# EAGLE design power system (EAGLE 7.1.0)
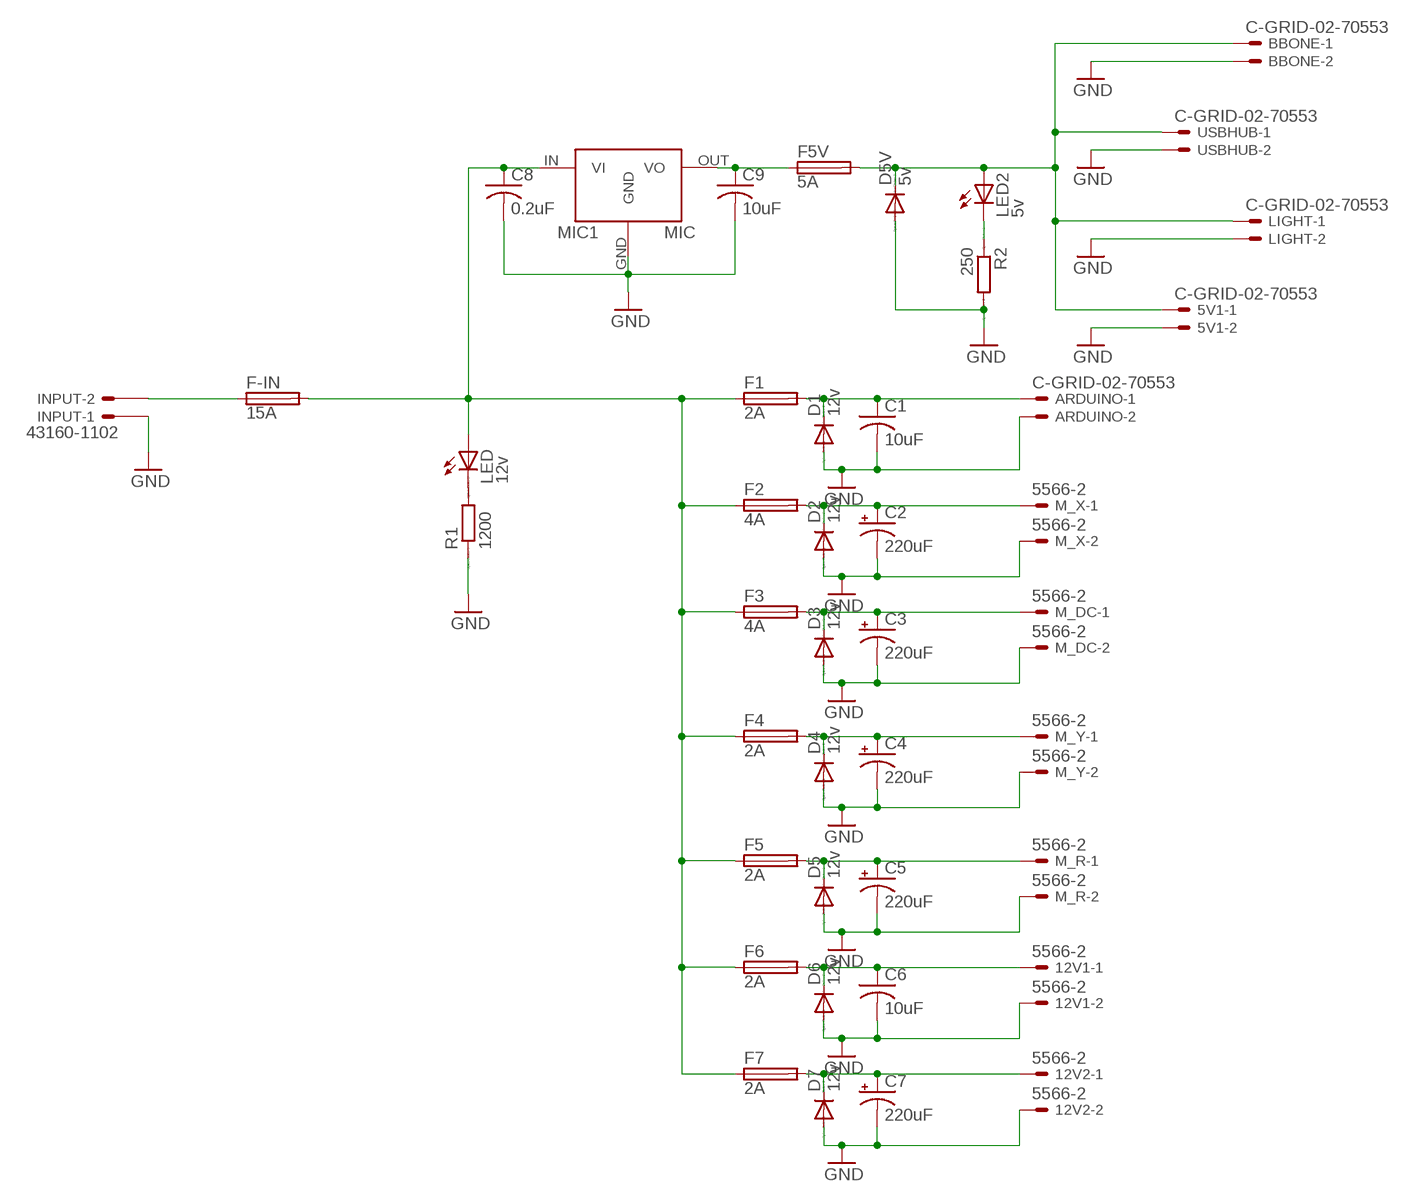
[diagram p0: schematic, sheet 1]

## Parts
5V1  C-GRID-02-70553  [70553-02]
12V1  5566-2  [5566-2]
12V2  5566-2  [5566-2]
ARDUINO  C-GRID-02-70553  [70553-02]
BBONE  C-GRID-02-70553  [70553-02]
C1  10uF  C-USC1206  [C1206]
C2  220uF  CAP_POLF80  [NIPPON_F80]
C3  220uF  CAP_POLF80  [NIPPON_F80]
C4  220uF  CAP_POLF80  [NIPPON_F80]
C5  220uF  CAP_POLF80  [NIPPON_F80]
C6  10uF  C-USC1206  [C1206]
C7  220uF  CAP_POLF80  [NIPPON_F80]
C8  0.2uF  C-USC1206  [C1206]
C9  10uF  C-USC1206  [C1206]
D1  12v  DIODE-DO214AC  [DO214AC]
D2  12v  DIODE-DO214AC  [DO214AC]
D3  12v  DIODE-DO214AC  [DO214AC]
D4  12v  DIODE-DO214AC  [DO214AC]
D5  12v  DIODE-DO214AC  [DO214AC]
D5V  5v  DIODE-DO214AC  [DO214AC]
D6  12v  DIODE-DO214AC  [DO214AC]
D7  12v  DIODE-DO214AC  [DO214AC]
F1  2A  TE5  [TE5]
F2  4A  TE5  [TE5]
F3  4A  TE5  [TE5]
F4  2A  TE5  [TE5]
F5  2A  TE5  [TE5]
F5V  5A  TE5  [TE5]
F6  2A  TE5  [TE5]
F7  2A  TE5  [TE5]
F-IN  15A  FUSEBLANK_5X20MM  [FUSE_HOLDER_5X20MM]
INPUT  43160-1102  [43160-XX02]
LED  12v  LED5MM  [LED5MM]
LED2  5v  LED5MM  [LED5MM]
LIGHT  C-GRID-02-70553  [70553-02]
M_DC  5566-2  [5566-2]
M_R  5566-2  [5566-2]
M_X  5566-2  [5566-2]
M_Y  5566-2  [5566-2]
MIC1  MIC29300  [TO220CS]
R1  1200  RR1206  [R1206]
R2  250  RR1206  [R1206]
USBHUB  C-GRID-02-70553  [70553-02]

## Nets
GND: 5V1.2 12V1.2 12V2.2 ARDUINO.2 BBONE.2 C1.2 C2.- C3.- C4.- C5.- C6.2 C7.- C8.2 C9.2 D1.A D2.A D3.A D4.A D5.A D5V.A D6.A D7.A INPUT.1@1(-1:S) LIGHT.2 M_DC.2 M_R.2 M_X.2 M_Y.2 MIC1.GND R1.1 R2.2 USBHUB.2
N$2: ARDUINO.1 C1.1 D1.C F1.2
N$3: F-IN.1 INPUT.2@1(-2:S)
N$4: C2.+ D2.C F2.2 M_X.1
N$5: 5V1.1 BBONE.1 D5V.C F5V.2 LED2.A LIGHT.1 USBHUB.1
N$6: C3.+ D3.C F3.2 M_DC.1
N$7: C9.1 F5V.1 MIC1.OUT(VO)
N$8: C8.1 F1.1 F2.1 F3.1 F4.1 F5.1 F6.1 F7.1 F-IN.2 LED.A MIC1.IN(VI)
N$9: LED2.K(C) R2.1
N$12: C4.+ D4.C F4.2 M_Y.1
N$14: LED.K(C) R1.2
N$15: C5.+ D5.C F5.2 M_R.1
N$17: 12V1.1 C6.1 D6.C F6.2
N$19: 12V2.1 C7.+ D7.C F7.2
Unconnected: INPUT.1@2(-1:S) INPUT.2@2(-2:S)

## Library data of the parts
5V1 ARDUINO BBONE LIGHT USBHUB = con-molex:C-GRID-02: CONNECTOR wire to board 2.54 mm (0.100") pitch header; OC_FARNELL: unknown; OC_NEWARK: unknown
12V1 12V2 M_DC M_R M_X M_Y = con-molex:5566-2: Mini FIT connector 2 pol Source: http://www.molex.com; OC_FARNELL: 1822072; OC_NEWARK: unknown
C1 C6 C8 C9 = resistor:C-US: CAPACITOR, American symbol
C2-C5 C7 = SparkFun-Capacitors:CAP_POL: Capacitor Polarized These are standard SMD and PTH capacitors. Normally 10uF, 47uF, and 100uF in electrolytic and tantalum varieties. Always verify the external diameter of the through hole cap, it varies with capacity, voltage, and manufacturer. The EIA devices should be standard.
D1-D5 D5V D6 D7 = diode:DIODE-: DIODE
F1-F5 F5V F6 F7 = fuse:TE5: FUSE Wickmann; OC_FARNELL: unknown; OC_NEWARK: unknown
F-IN = fuse:FUSE: Fuse; OC_FARNELL: unknown; OC_NEWARK: unknown
INPUT = con-molex:43160-*02: SDA-43160 Connector Source: http://www.molex.com/pdm_docs/sd/431601306_sd.pdf; MF: WALDOM/MOLEX; MPN: 43160-1102; OC_FARNELL: unknown; OC_NEWARK: 54H0255
LED LED2 = led:LED: LED OSRAM: - CHIPLED LG R971, LG N971, LY N971, LG Q971, LY Q971, LO R971, LY R971 LH N974, LH R974 LS Q976, LO Q976, LY Q976 LO Q996 - Hyper CHIPLED LW Q18S LB Q993, LB Q99A, LB R99A - SideLED LS A670, LO A670, LY A670, LG A670, LP A670 LB A673, LV A673, LT A673, LW A673 LH A674 LY A675 LS A676, LA A676, LO A676, LY A676, LW A676 LS A679, LY A679, LG A679 - Hyper Micro SIDELED® LS Y876, LA Y876, LO Y876, LY Y876 LT Y87S - SmartLED LW L88C, LW L88S LB L89C, LB L89S, LG L890 LS L89K, LO L89K, LY L89K LS L896, LA L896, LO L896, LY L896 - TOPLED LS T670, LO T670, LY T670, LG T670, LP T670 LSG T670, LSP T670, LSY T670, LOP T670, LYG T670 LG T671, LOG T671, LSG T671 LB T673, LV T673, LT T673, LW T673 LH T674 LS T676, LA T676, LO T676, LY T676, LB T676, LH T676, LSB T676, LW T676 LB T67C, LV T67C, LT T67C, LS T67K, LO T67K, LY T67K, LW E67C LS E67B, LA E67B, LO E67B, LY E67B, LB E67C, LV E67C, LT E67C LW T67C LS T679, LY T679, LG T679 LS T770, LO T770, LY T770, LG T770, LP T770 LB T773, LV T773, LT T773, LW T773 LH T774 LS E675, LA E675, LY E675, LS T675 LS T776, LA T776, LO T776, LY T776, LB T776 LHGB T686 LT T68C, LB T68C - Hyper Mini TOPLED® LB M676 - Mini TOPLED Santana® LG M470 LS M47K, LO M47K, LY M47K Source: http://www.osram.convergy.de LUXEON: - LUMILED® LXK2-PW12-R00, LXK2-PW12-S00, LXK2-PW14-U00, LXK2-PW14-V00 LXK2-PM12-R00, LXK2-PM12-S00, LXK2-PM14-U00 LXK2-PE12-Q00, LXK2-PE12-R00, LXK2-PE12-S00, LXK2-PE14-T00, LXK2-PE14-U00 LXK2-PB12-K00, LXK2-PB12-L00, LXK2-PB12-M00, LXK2-PB14-N00, LXK2-PB14-P00, LXK2-PB14-Q00 LXK2-PR12-L00, LXK2-PR12-M00, LXK2-PR14-Q00, LXK2-PR14-R00 LXK2-PD12-Q00, LXK2-PD12-R00, LXK2-PD12-S00 LXK2-PH12-R00, LXK2-PH12-S00 LXK2-PL12-P00, LXK2-PL12-Q00, LXK2-PL12-R00 Source: www.luxeon.com KINGBRIGHT: KA-3528ASYC Source: www.kingbright.com
MIC1 = Powerlib:MIC29300
R1 R2 = eagle-ltspice:R: RESISTOR, European symbol; SPICEMODEL: NONE; SPICEPREFIX: R

## Board
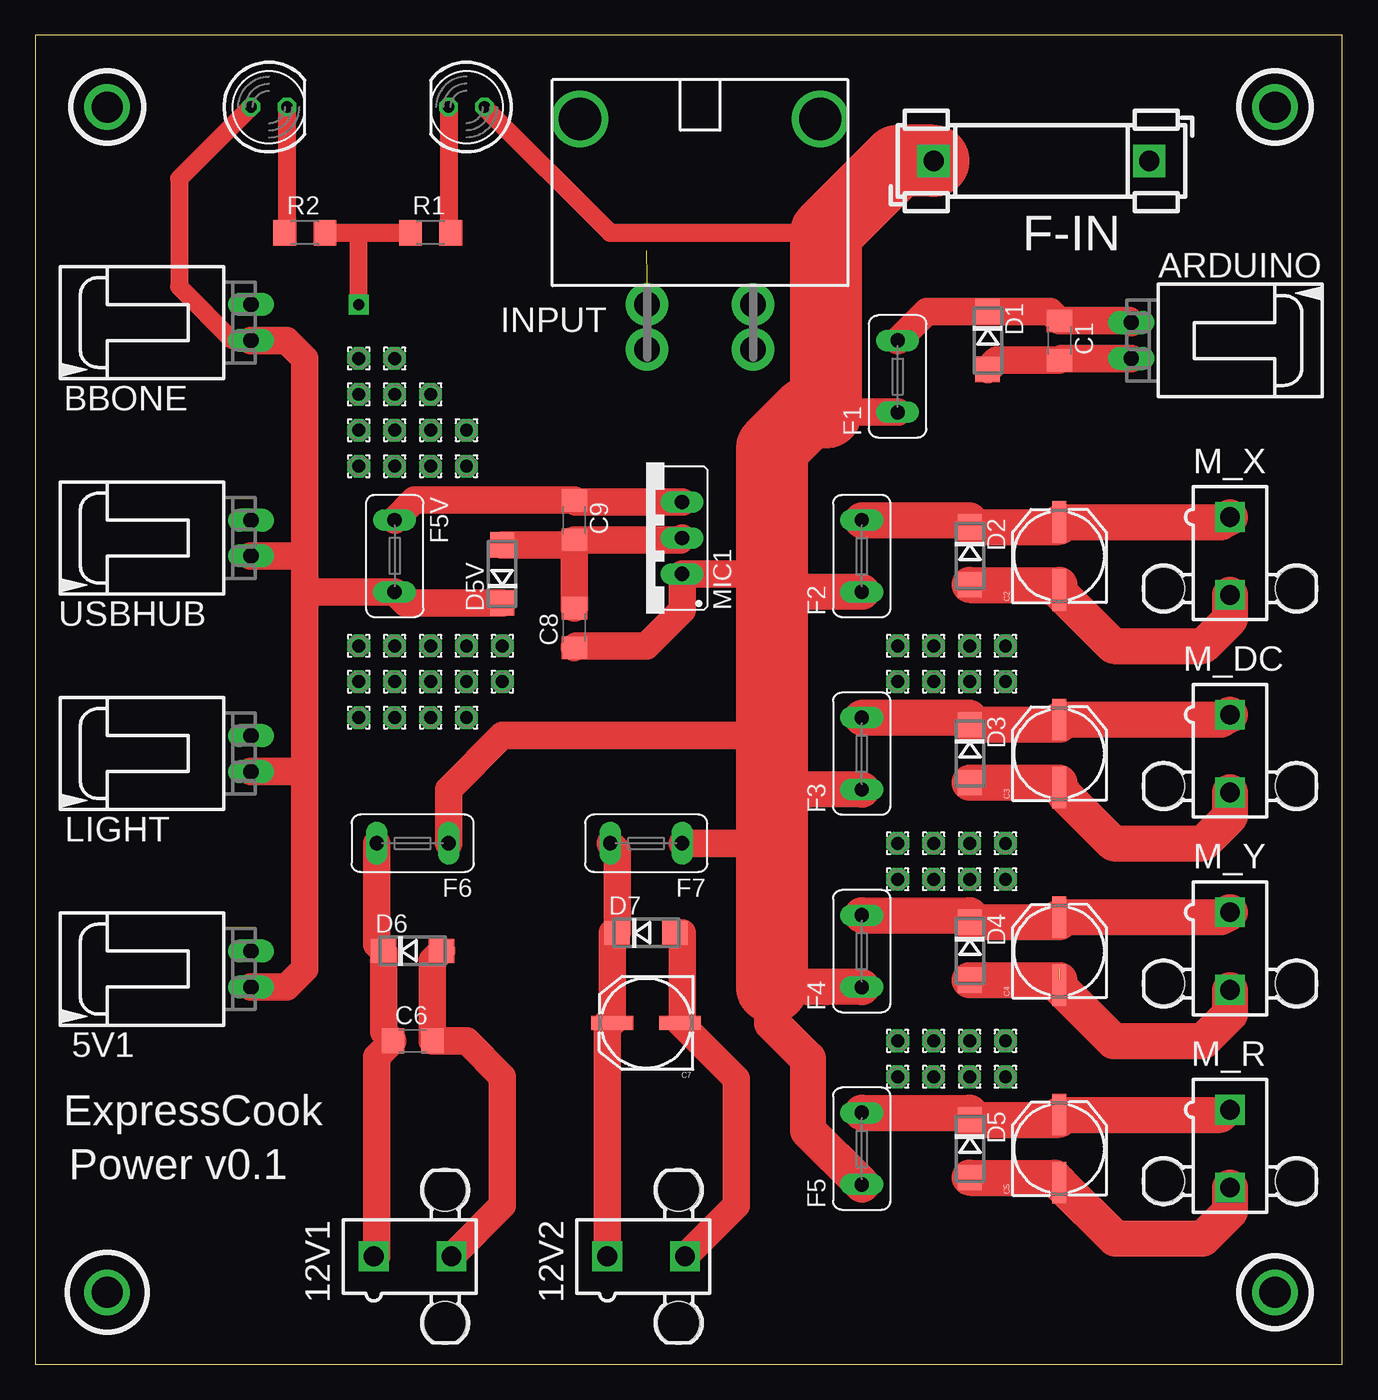
[diagram p1: board, top side]
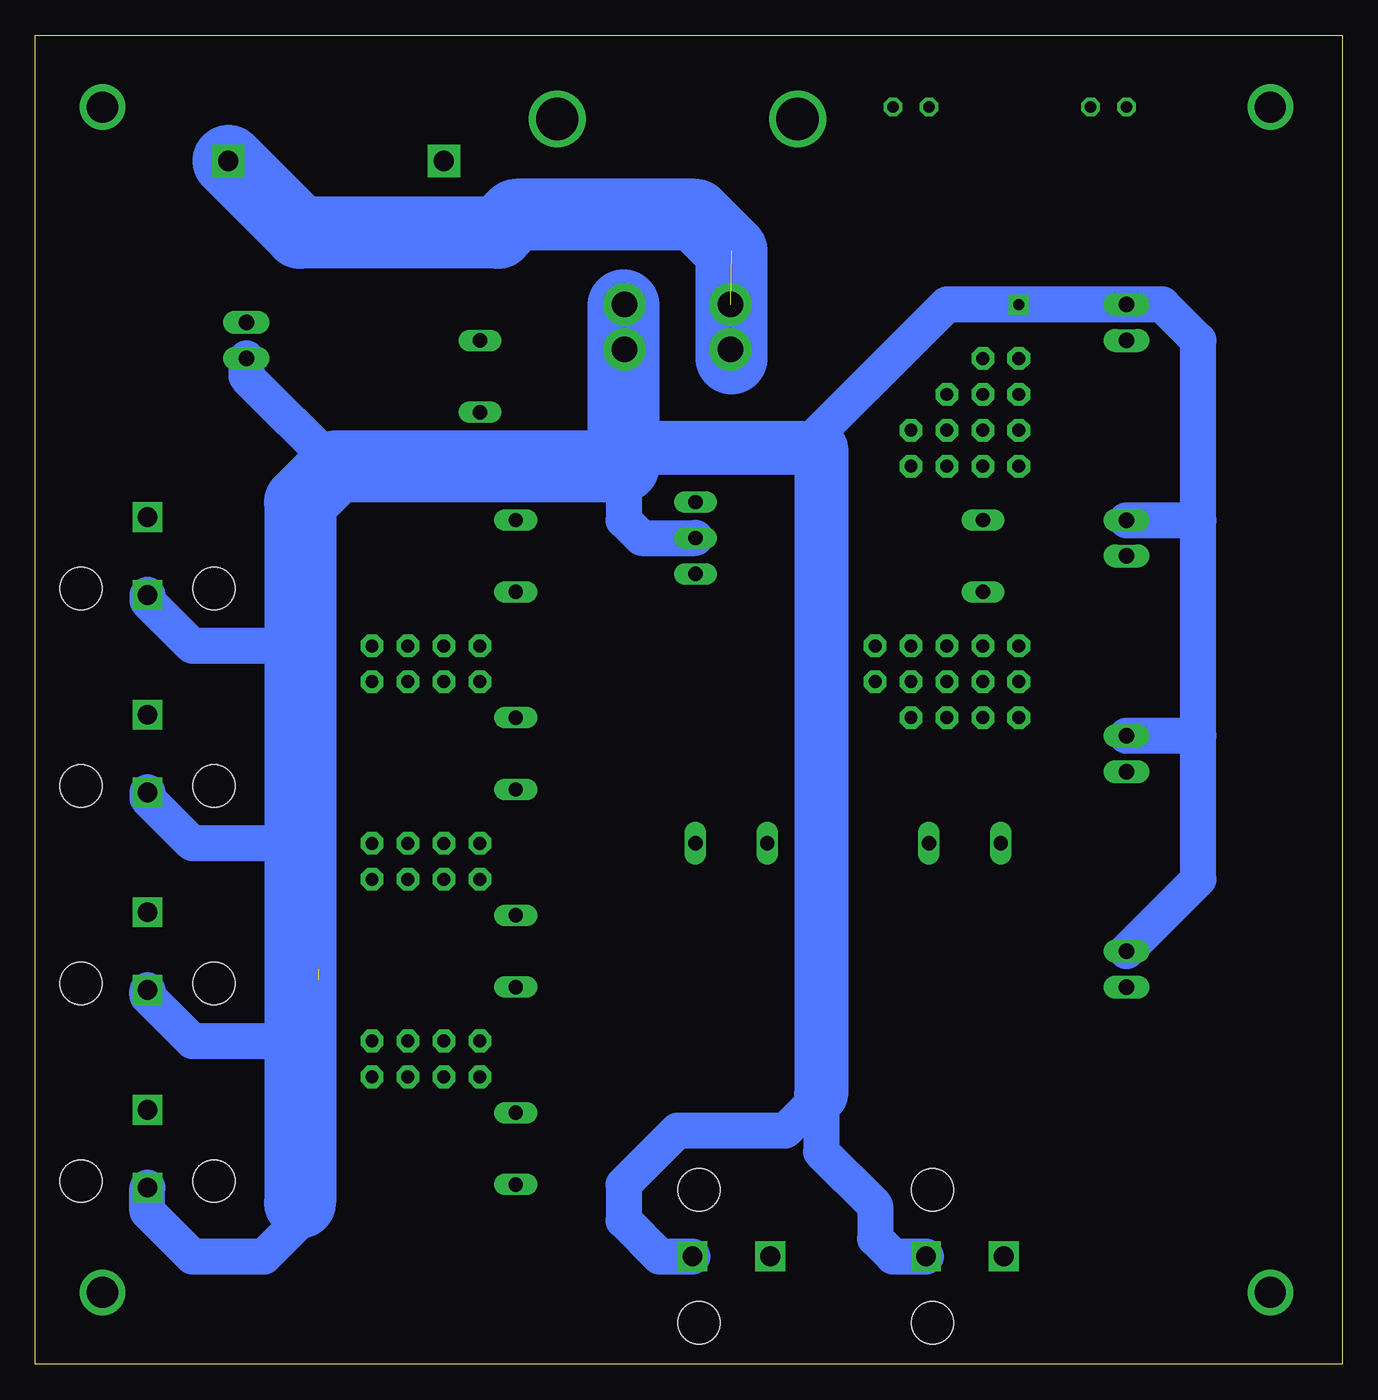
[diagram p2: board, bottom side, seen from below]

Size 92.38 x 93.97 mm. Coordinates in mm from the lower left corner, seen from the top.
Outline: 0,0 92.38,0 92.38,93.97 0,93.97 0,0
Copper layers (1*16): Top 0.035mm / dielectric 1.5mm / Bottom 0.035mm
Design rules "default": minimum track width 10mil, minimum drill 24mil, track to track 8mil, track to pad 8mil, pad to pad 8mil, via to via 8mil, smd to smd 8mil, copper to edge 40mil, drill to drill 8mil, minimum pad ring 10mil, minimum via ring 8mil, stop-mask expansion 4mil, vias tented up to drill 0mil, thermal gap 10mil

### Footprints (pad centres in the part's own frame; a part is rotated, then mirrored left to right if it is on the bottom)
70553-02 = drill 1.092 long: 1 -1.27,-7.62; 2 1.27,-7.62
5566-2 = drill 1.4 square: 1 0,-2.75; 2 0,2.75 | hole 3: 4.7,2.29; -4.7,2.29
C1206 = smd 1.6 x 1.8: 1 -1.4,0; 2 1.4,0
NIPPON_F80 = smd 2.95 x 1: + 2.4,0; - -2.4,0
DO214AC = smd 1.8 x 1.7: A 2.05,0; C -2.05,0
1,6/0,9 = drill 0.914 pad 1.6 octagon: 1 0,0
TE5 = drill 1.016 long: 1 -2.54,0; 2 2.54,0
FUSE_HOLDER_5X20MM = drill 1.422 pad 2.286 square: 1 0,0; 2 15.24,0
43160-XX02 = drill 1.8 pad 3: 1@1 -3.745,0; 1@2 -3.745,3.18; 2@1 3.745,0; 2@2 3.745,3.18 | drill 3 pad 3.4: M1 -8.495,-13.13; M2 8.495,-13.13
LED5MM = drill 0.813 octagon: A -1.27,0; K 1.27,0
TO220CS = drill 1.016 long: GND 0,-2.54; IN -2.54,-2.54; OUT 2.54,-2.54
R1206 = smd 1.6 x 1.803: 1 -1.422,0; 2 1.422,0

### Placement (x,y rotation side)
5V1  7.62,27.94 90 top
12V1  26.67,7.62 270 top
12V2  43.18,7.62 270 top
ARDUINO  85.09,72.39 270 top
BBONE  7.62,73.66 90 top
C1  72.39,72.39 270 top
C2  72.39,57.15 90 top
C3  72.39,43.18 90 top
C4  72.39,29.21 90 top
C5  72.39,15.24 90 top
C6  26.67,22.86 0 top
C7  43.18,24.13 180 top
C8  38.1,52.07 90 top
C9  38.1,59.69 270 top
D1  67.31,72.39 270 top
D2  66.04,57.15 270 top
D3  66.04,43.18 270 top
D4  66.04,29.21 270 top
D5  66.04,15.24 270 top
D5V  33.02,55.88 90 top
D6  26.67,29.21 0 top
D7  43.18,30.48 0 top
E$1  [1,6/0,9]  22.86,50.8 0 top
E$2  [1,6/0,9]  25.4,50.8 0 top
E$3  [1,6/0,9]  27.94,50.8 0 top
E$4  [1,6/0,9]  30.48,50.8 0 top
E$5  [1,6/0,9]  33.02,50.8 0 top
E$6  [1,6/0,9]  33.02,48.26 0 top
E$7  [1,6/0,9]  30.48,48.26 0 top
E$8  [1,6/0,9]  27.94,48.26 0 top
E$9  [1,6/0,9]  25.4,48.26 0 top
E$10  [1,6/0,9]  22.86,48.26 0 top
E$11  [1,6/0,9]  22.86,45.72 0 top
E$12  [1,6/0,9]  25.4,45.72 0 top
E$13  [1,6/0,9]  27.94,45.72 0 top
E$14  [1,6/0,9]  30.48,45.72 0 top
E$15  [1,6/0,9]  60.96,36.83 0 top
E$16  [1,6/0,9]  60.96,34.29 0 top
E$17  [1,6/0,9]  63.5,34.29 0 top
E$18  [1,6/0,9]  63.5,36.83 0 top
E$19  [1,6/0,9]  66.04,36.83 0 top
E$20  [1,6/0,9]  66.04,34.29 0 top
E$21  [1,6/0,9]  68.58,34.29 0 top
E$22  [1,6/0,9]  68.58,36.83 0 top
E$24  [1,6/0,9]  60.96,22.86 0 top
E$25  [1,6/0,9]  63.5,22.86 0 top
E$26  [1,6/0,9]  66.04,22.86 0 top
E$27  [1,6/0,9]  68.58,22.86 0 top
E$30  [1,6/0,9]  68.58,20.32 0 top
E$31  [1,6/0,9]  66.04,20.32 0 top
E$32  [1,6/0,9]  63.5,20.32 0 top
E$33  [1,6/0,9]  60.96,20.32 0 top
E$34  [1,6/0,9]  22.86,71.12 0 top
E$35  [1,6/0,9]  25.4,71.12 0 top
E$36  [1,6/0,9]  22.86,68.58 0 top
E$37  [1,6/0,9]  25.4,68.58 0 top
E$38  [1,6/0,9]  27.94,68.58 0 top
E$39  [1,6/0,9]  22.86,66.04 0 top
E$40  [1,6/0,9]  25.4,66.04 0 top
E$41  [1,6/0,9]  27.94,66.04 0 top
E$42  [1,6/0,9]  30.48,66.04 0 top
E$43  [1,6/0,9]  22.86,63.5 0 top
E$44  [1,6/0,9]  25.4,63.5 0 top
E$45  [1,6/0,9]  27.94,63.5 0 top
E$46  [1,6/0,9]  30.48,63.5 0 top
E$48  [1,6/0,9]  60.96,50.8 0 top
E$49  [1,6/0,9]  60.96,48.26 0 top
E$50  [1,6/0,9]  63.5,48.26 0 top
E$51  [1,6/0,9]  63.5,50.8 0 top
E$52  [1,6/0,9]  66.04,50.8 0 top
E$53  [1,6/0,9]  66.04,48.26 0 top
E$54  [1,6/0,9]  68.58,48.26 0 top
E$55  [1,6/0,9]  68.58,50.8 0 top
F1  60.96,69.85 90 top
F2  58.42,57.15 90 top
F3  58.42,43.18 90 top
F4  58.42,29.21 90 top
F5  58.42,15.24 90 top
F5V  25.4,57.15 270 top
F6  26.67,36.83 180 top
F7  43.18,36.83 180 top
F-IN  78.74,85.09 180 top
INPUT  46.99,74.93 180 top
LED  30.48,88.9 180 top
LED2  16.51,88.9 0 top
LIGHT  7.62,43.18 90 top
M_DC  84.45,43.18 180 top
M_R  84.45,15.24 180 top
M_X  84.45,57.15 180 top
M_Y  84.45,29.21 180 top
MIC1  43.18,58.42 90 top
R1  27.94,80.01 0 top
R2  19.05,80.01 0 top
USBHUB  7.62,58.42 90 top

### Tracks (layer width: path | path; a pad name or v marks a point on that pad's centre or on a via)
GND  (via drill 0.8 pad 1.42)  (1 unrouted)
  Top 0.254: D7.A 45.72,30.48
  Top 1.27: R2.2 22.86,80.01 | 22.86,80.01 R1.1 | v22.86,74.93 22.86,80.01
  Top 1.93: 72.39,55.1 C2.- 72.39,54.61 | 72.39,41.13 C3.- 72.74,40.43 72.74,40.29 | 45.72,30.48 45.72,24.13 C7.- 49.53,20.18 49.53,11.22 12V2.2 | C8.2 C9.2 | D5V.A 37.74,57.93 C9.2 | C9.2 45.59,58.29 MIC1.GND | C4.- 72.39,26.67 | 72.04,13.19 C5.- | 12V1.2 33.02,11.22 33.02,20.32 30.48,22.86 C6.2 28.07,28.56 D6.A | D1.A 67.96,70.99 C1.2 72.52,71.12 ARDUINO.2
  Top 2.54: D2.A 72.39,55.1 | D3.A 72.39,41.13 | D4.A 72.39,27.16 C4.- | 72.39,54.61 76.2,50.8 82.55,50.8 84.45,52.7 M_X.2 | 72.74,40.29 76.2,36.83 82.55,36.83 84.45,38.73 M_DC.2 | 72.39,26.67 76.2,22.86 82.55,22.86 84.45,24.77 M_Y.2 | D5.A 72.04,13.19 | C5.- 76.34,8.89 82.55,8.89 84.45,10.79 M_R.2
  Bottom 1.93: 50.8,64.77 50.8,63.5 50.8,62.23 | 29.21,7.83 12V1.2 29.42,7.83
  Bottom 2.54: 5V1.2 10.16,34.29 10.16,44.45 | 10.16,44.45 10.16,59.69 | 10.16,59.69 10.16,72.39 12.7,74.93 BBONE.2 v22.86,74.93 27.94,74.93 38.1,64.77 36.83,64.77 | USBHUB.2 10.16,59.69 | LIGHT.2 10.16,44.45 | 74.93,22.86 81.28,22.86 84.45,26.04 M_Y.2 | 50.8,74.87 INPUT.1@1 | ARDUINO.2 77.47,69.85 71.12,63.5 | 12V2.2 48.26,7.62 50.8,10.16 50.8,12.7 46.99,16.51 39.37,16.51 36.83,19.05 36.83,15.03 33.02,11.22 33.02,8.89 31.75,7.62 12V1.2 | 50.8,62.23 50.8,59.69 49.53,58.42 MIC1.GND | M_X.2 84.45,53.97 81.28,50.8 73.66,50.8 73.66,42.05 C3.- 72.39,27.94 | M_DC.2 84.45,40 81.28,36.83 73.66,36.83 | M_R.2 84.45,10.79 81.28,7.62 76.2,7.62 73.66,10.16 73.66,11.43
  Bottom 3.81: 38.1,64.77 50.8,64.77 | 36.83,64.77 36.83,19.05
  Bottom 5.08: 50.8,64.77 50.8,74.87 | 50.8,63.5 71.12,63.5 73.66,60.96 73.66,50.8 73.66,36.83 73.66,11.43
N$1  (via drill 2.2)
  other vias: 87.63,88.9
N$2
  Top 1.93: F1.2 63.01,74.44 D1.C 71.74,74.44 C1.1 77.34,73.79 ARDUINO.1
N$3  (1 unrouted)
  Bottom 5.08: 43.18,71.12 43.18,78.74 45.72,81.28 58.42,81.28 59.69,80.01 73.66,80.01 F-IN.1
N$4
  Top 1.93: 72.39,59.2 C2.+ | 66.04,59.69 D2.C
  Top 2.54: C2.+ 83.82,59.55 M_X.1 | D2.C 72.39,59.2 | F2.2 66.04,59.69
N$5
  Top 1.27: LED2.A 10.16,83.82 10.16,76.2 13.97,72.39 BBONE.1
  Top 1.93: D5V.C 26.18,53.83 F5V.2 19.05,54.61 | 19.05,54.61 19.05,57.15 | 19.05,57.15 19.05,71.12 17.78,72.39 BBONE.1 | 19.05,54.61 19.05,41.91 | 19.05,41.91 19.05,27.94 17.78,26.67 5V1.1 | USBHUB.1 19.05,57.15 | LIGHT.1 19.05,41.91
N$6
  Top 1.93: 72.39,45.23 C3.+
  Top 2.54: C3.+ 83.82,45.58 M_DC.1 | 72.39,45.23 D3.C 66.04,45.72 F3.2
N$7
  Top 1.93: MIC1.OUT 38.23,60.96 C9.1 26.8,61.09 F5V.1
N$8
  Top 1.27: LED.A 40.64,80.01 54.61,80.01
  Top 1.93: C8.1 38.23,50.8 43.18,50.8 45.72,53.34 MIC1.IN 52.07,55.88 53.34,54.61 54.61,54.61 | F6.1 29.21,40.64 33.02,44.45 52.07,44.45 | F1.1 55.88,67.31 54.61,67.31 | 55.88,80.01 54.61,80.01 | 54.61,40.64 53.34,40.64 | 53.34,40.64 52.07,40.64 | 52.07,26.67 55.88,26.67 | F7.1 53.34,36.83 53.34,40.64
  Top 2.54: F2.1 54.61,54.61 | F4.1 55.88,26.67 54.61,26.67 | F3.1 54.61,40.64 | F5.1 54.61,16.51 54.61,21.59 52.07,24.13 52.07,27.94
  Top 5.08: F-IN.2 60.96,85.09 55.88,80.01 55.88,67.31 | 54.61,67.31 52.07,64.77 52.07,55.88 52.07,44.45 52.07,40.64 52.07,27.94 52.07,26.67
N$9
  Top 1.27: LED2.K 17.78,80.16 R2.1
N$10  (via drill 2.2)
  other vias: 5.08,5.08
N$11  (via drill 2.2)
  other vias: 87.63,5.08
N$12
  Top 1.93: 72.39,31.26 C4.+ | 66.04,31.75 D4.C
  Top 2.54: C4.+ 83.82,31.61 M_Y.1 | D4.C 72.39,31.26 | F4.2 66.04,31.75
N$13  (via drill 2.2)
  other vias: 5.08,88.9
N$14
  Top 1.27: LED.K 29.21,80.16 R1.2
N$15
  Top 0.254: M_R.1 83.8,18.14 83.8,17.64
  Top 1.93: 83.8,17.64 83.82,17.64 83.82,17.78 | 72.39,17.29 C5.+ | 66.04,17.78 D5.C
  Top 2.54: C5.+ 83.8,17.64 | D5.C 72.39,17.29 | F5.2 66.04,17.78
N$17
  Top 1.93: F6.2 24.13,29.7 D6.C 24.62,23.51 C6.1 24.13,21.72 24.13,7.62 12V1.1
N$19
  Top 1.93: 12V2.1 40.43,24.13 C7.+ 40.78,30.48 D7.C 41.13,36.34 F7.2

### Text on the board
tPlace: ExpressCook | Power v0.1